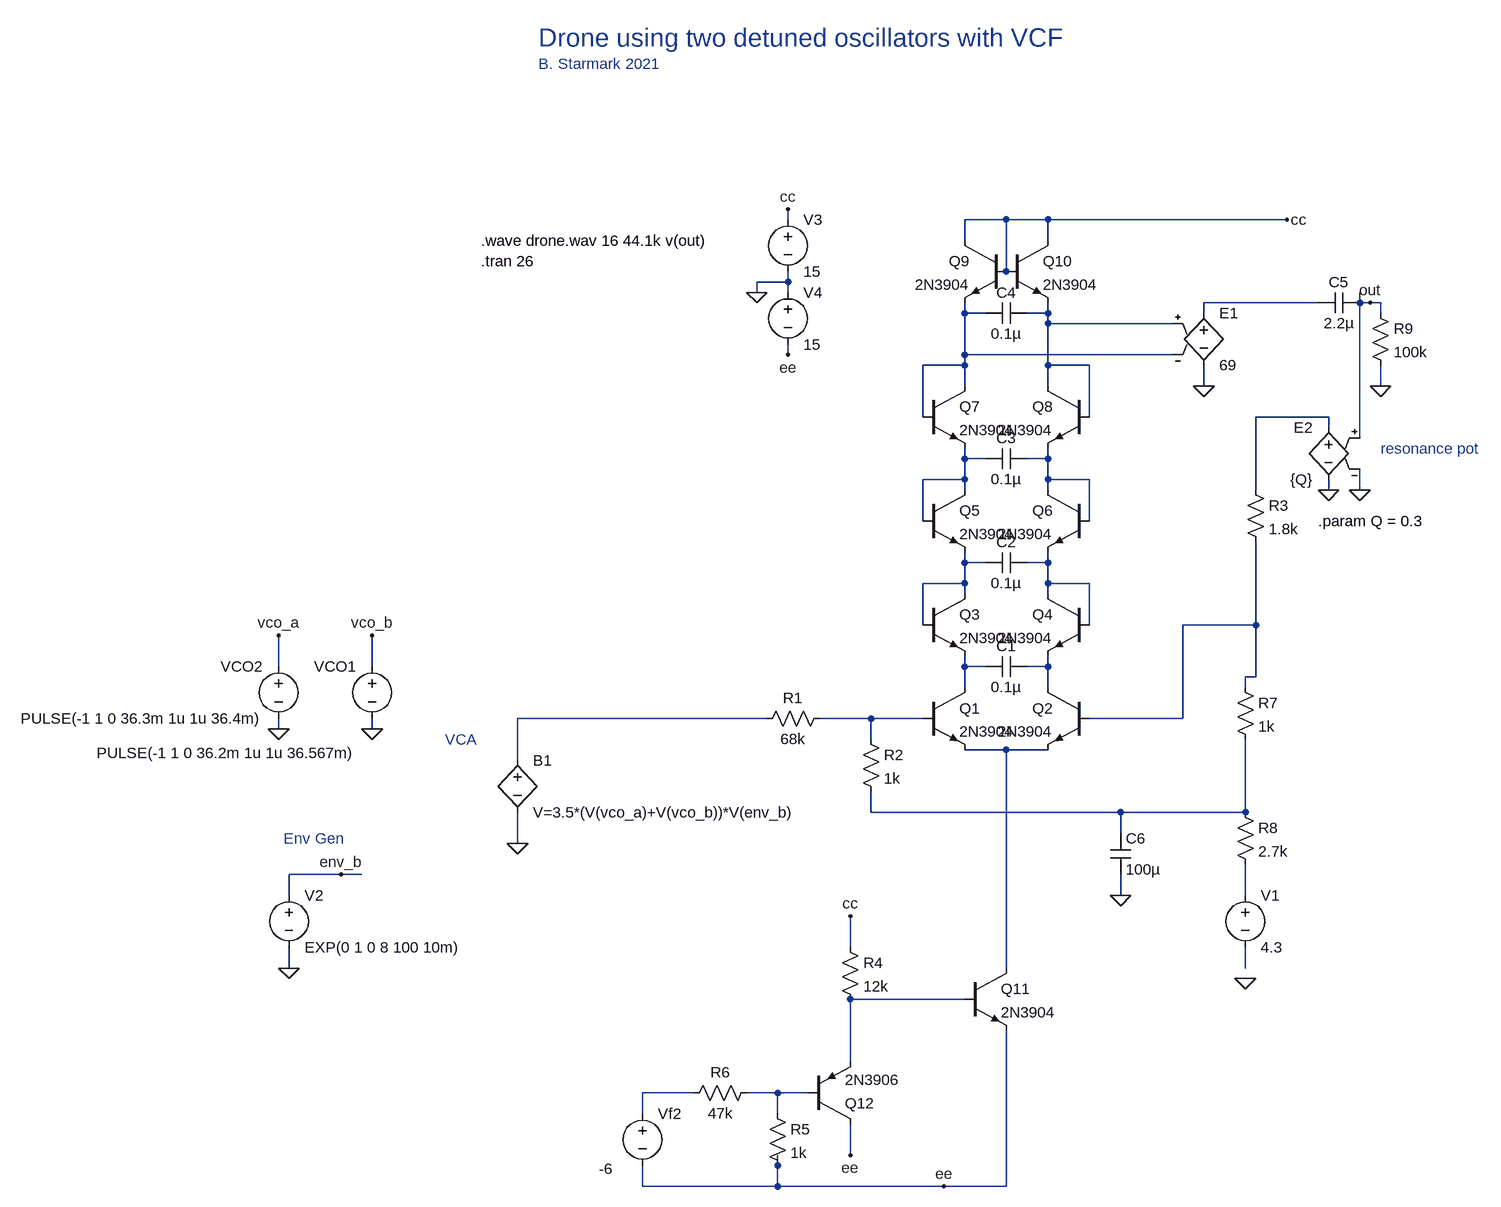
[diagram p0: schematic drone.asc]
drone.asc, the LTspice schematic file:
Version 4
SHEET 1 1536 820
WIRE -64 -752 -64 -768
WIRE 272 -752 208 -752
WIRE 336 -752 272 -752
WIRE 704 -752 336 -752
WIRE 208 -720 208 -752
WIRE 336 -720 336 -752
WIRE 272 -672 272 -752
WIRE -64 -656 -64 -672
WIRE -64 -656 -112 -656
WIRE -112 -640 -112 -656
WIRE -64 -640 -64 -656
WIRE 752 -624 576 -624
WIRE 816 -624 816 -640
WIRE 832 -624 816 -624
WIRE 848 -624 832 -624
WIRE 208 -608 208 -624
WIRE 240 -608 208 -608
WIRE 336 -608 336 -624
WIRE 336 -608 304 -608
WIRE 576 -608 576 -624
WIRE 848 -608 848 -624
WIRE 336 -592 336 -608
WIRE 528 -592 336 -592
WIRE -64 -544 -64 -560
WIRE 208 -544 208 -608
WIRE 528 -544 208 -544
WIRE 208 -528 208 -544
WIRE 208 -528 144 -528
WIRE 336 -528 336 -592
WIRE 400 -528 336 -528
WIRE 208 -496 208 -528
WIRE 336 -496 336 -528
WIRE 576 -496 576 -528
WIRE 848 -496 848 -528
WIRE 144 -448 144 -528
WIRE 400 -448 400 -528
WIRE 768 -448 656 -448
WIRE 768 -432 768 -448
WIRE 816 -416 816 -624
WIRE 208 -384 208 -400
WIRE 240 -384 208 -384
WIRE 336 -384 336 -400
WIRE 336 -384 304 -384
WIRE 208 -352 208 -384
WIRE 208 -352 144 -352
WIRE 336 -352 336 -384
WIRE 400 -352 336 -352
WIRE 208 -336 208 -352
WIRE 336 -336 336 -352
WIRE 656 -336 656 -448
WIRE 768 -336 768 -352
WIRE 816 -336 816 -368
WIRE 144 -288 144 -352
WIRE 400 -288 400 -352
WIRE 208 -224 208 -240
WIRE 240 -224 208 -224
WIRE 336 -224 336 -240
WIRE 336 -224 304 -224
WIRE 208 -192 208 -224
WIRE 208 -192 144 -192
WIRE 336 -192 336 -224
WIRE 400 -192 336 -192
WIRE 208 -176 208 -192
WIRE 336 -176 336 -192
WIRE 144 -128 144 -192
WIRE 400 -128 400 -192
WIRE 656 -128 656 -256
WIRE 656 -128 544 -128
WIRE -848 -64 -848 -112
WIRE -704 -64 -704 -112
WIRE 208 -64 208 -80
WIRE 240 -64 208 -64
WIRE 336 -64 336 -80
WIRE 336 -64 304 -64
WIRE 656 -48 656 -128
WIRE 656 -48 640 -48
WIRE 208 -32 208 -64
WIRE 336 -32 336 -64
WIRE 640 -32 640 -48
WIRE -96 16 -480 16
WIRE 64 16 -16 16
WIRE 144 16 64 16
WIRE 544 16 544 -128
WIRE 544 16 400 16
WIRE -848 32 -848 16
WIRE -704 32 -704 16
WIRE 64 48 64 16
WIRE 272 64 208 64
WIRE 336 64 272 64
WIRE -480 80 -480 16
WIRE 64 160 64 128
WIRE 448 160 64 160
WIRE 640 160 640 48
WIRE 640 160 448 160
WIRE 448 192 448 160
WIRE -480 208 -480 160
WIRE -752 256 -832 256
WIRE -720 256 -752 256
WIRE -832 288 -832 256
WIRE 448 288 448 256
WIRE 640 288 640 240
WIRE 32 368 32 320
WIRE -832 400 -832 368
WIRE 272 400 272 64
WIRE 640 400 640 368
WIRE 208 448 32 448
WIRE 32 544 32 448
WIRE -208 592 -288 592
WIRE -80 592 -128 592
WIRE -32 592 -80 592
WIRE -288 624 -288 592
WIRE -80 624 -80 592
WIRE 32 688 32 640
WIRE -80 704 -80 688
WIRE -288 736 -288 704
WIRE -80 736 -80 704
WIRE -80 736 -288 736
WIRE 176 736 -80 736
WIRE 272 736 272 496
WIRE 272 736 176 736
FLAG -112 -640 0
FLAG -64 -544 ee
FLAG -64 -768 cc
FLAG -480 208 0
FLAG 704 -752 cc
FLAG 848 -496 0
FLAG 576 -496 0
FLAG 32 320 cc
FLAG 32 688 ee
FLAG 176 736 ee
FLAG 816 -336 0
FLAG 768 -336 0
FLAG 640 416 0
FLAG 448 288 0
FLAG -848 -112 vco_a
FLAG -704 32 0
FLAG -704 -112 vco_b
FLAG -848 32 0
FLAG 832 -624 out
FLAG -832 400 0
FLAG -752 256 env_b
SYMBOL voltage -64 -768 R0
SYMATTR InstName V3
SYMATTR Value 15
SYMBOL voltage -64 -656 R0
SYMATTR InstName V4
SYMATTR Value 15
SYMBOL bv -480 64 R0
SYMATTR InstName B1
SYMATTR Value V=3.5*(V(vco_a)+V(vco_b))*V(env_b)
SYMBOL npn 144 -32 R0
SYMATTR InstName Q1
SYMATTR Value 2N3904
SYMBOL npn 400 -32 M0
SYMATTR InstName Q2
SYMATTR Value 2N3904
SYMBOL cap 304 -80 R90
WINDOW 0 0 32 VBottom 2
WINDOW 3 32 32 VTop 2
SYMATTR InstName C1
SYMATTR Value 0.1µ
SYMBOL npn 144 -176 R0
SYMATTR InstName Q3
SYMATTR Value 2N3904
SYMBOL npn 400 -176 M0
SYMATTR InstName Q4
SYMATTR Value 2N3904
SYMBOL cap 304 -240 R90
WINDOW 0 0 32 VBottom 2
WINDOW 3 32 32 VTop 2
SYMATTR InstName C2
SYMATTR Value 0.1µ
SYMBOL npn 144 -336 R0
SYMATTR InstName Q5
SYMATTR Value 2N3904
SYMBOL npn 400 -336 M0
SYMATTR InstName Q6
SYMATTR Value 2N3904
SYMBOL cap 304 -400 R90
WINDOW 0 0 32 VBottom 2
WINDOW 3 32 32 VTop 2
SYMATTR InstName C3
SYMATTR Value 0.1µ
SYMBOL npn 144 -496 R0
SYMATTR InstName Q7
SYMATTR Value 2N3904
SYMBOL npn 400 -496 M0
SYMATTR InstName Q8
SYMATTR Value 2N3904
SYMBOL cap 304 -624 R90
WINDOW 0 0 32 VBottom 2
WINDOW 3 32 32 VTop 2
SYMATTR InstName C4
SYMATTR Value 0.1µ
SYMBOL npn 272 -720 M0
SYMATTR InstName Q9
SYMATTR Value 2N3904
SYMBOL npn 272 -720 R0
SYMATTR InstName Q10
SYMATTR Value 2N3904
SYMBOL cap 752 -608 R270
WINDOW 0 32 32 VTop 2
WINDOW 3 0 32 VBottom 2
SYMATTR InstName C5
SYMATTR Value 2.2µ
SYMBOL res 832 -624 R0
SYMATTR InstName R9
SYMATTR Value 100k
SYMBOL e 576 -624 R0
SYMATTR InstName E1
SYMATTR Value 69
SYMBOL res 0 0 R90
WINDOW 0 0 56 VBottom 2
WINDOW 3 32 56 VTop 2
SYMATTR InstName R1
SYMATTR Value 68k
SYMBOL res 48 32 R0
SYMATTR InstName R2
SYMATTR Value 1k
SYMBOL npn 208 400 R0
SYMATTR InstName Q11
SYMATTR Value 2N3904
SYMBOL pnp -32 640 M180
SYMATTR InstName Q12
SYMATTR Value 2N3906
SYMBOL res 16 352 R0
SYMATTR InstName R4
SYMATTR Value 12k
SYMBOL res -96 608 R0
SYMATTR InstName R5
SYMATTR Value 1k
SYMBOL res -112 576 R90
WINDOW 0 0 56 VBottom 2
WINDOW 3 32 56 VTop 2
SYMATTR InstName R6
SYMATTR Value 47k
SYMBOL e 768 -448 M0
SYMATTR InstName E2
SYMATTR Value {Q}
SYMBOL res 640 -352 R0
SYMATTR InstName R3
SYMATTR Value 1.8k
SYMBOL res 624 -48 R0
SYMATTR InstName R7
SYMATTR Value 1k
SYMBOL res 624 144 R0
SYMATTR InstName R8
SYMATTR Value 2.7k
SYMBOL voltage 640 272 R0
SYMATTR InstName V1
SYMATTR Value 4.3
SYMBOL cap 432 192 R0
SYMATTR InstName C6
SYMATTR Value 100µ
SYMBOL voltage -704 -80 M0
WINDOW 123 24 124 Left 2
WINDOW 39 0 0 Left 2
WINDOW 3 24 149 Left 2
SYMATTR InstName VCO1
SYMATTR Value PULSE(-1 1 0 36.2m 1u 1u 36.567m)
SYMBOL voltage -848 -80 M0
WINDOW 123 24 124 Left 2
WINDOW 39 0 0 Left 2
SYMATTR InstName VCO2
SYMATTR Value PULSE(-1 1 0 36.3m 1u 1u 36.4m)
SYMBOL voltage -288 608 R0
WINDOW 123 0 0 Left 0
WINDOW 39 0 0 Left 0
WINDOW 3 -67 101 Left 2
SYMATTR Value -6
SYMATTR InstName Vf2
SYMBOL voltage -832 272 R0
WINDOW 123 0 0 Left 0
WINDOW 39 0 0 Left 0
SYMATTR InstName V2
SYMATTR Value EXP(0 1 0 8 100 10m)
TEXT -536 -688 Left 2 !.tran 26
TEXT -448 -1032 Left 4 ;Drone using two detuned oscillators with VCF
TEXT -536 -720 Left 2 !.wave drone.wav 16 44.1k v(out)
TEXT 848 -400 Left 2 ;resonance pot
TEXT 752 -288 Left 2 !.param Q = 0.3
TEXT -592 48 Left 2 ;VCA
TEXT -840 200 Left 2 ;Env Gen
TEXT -448 -992 Left 2 ;B. Starmark 2021

The netlist it stands for:
* drone.asc
V3 cc 0 15
V4 0 ee 15
B1 N012 0 V=3.5*(V(vco_a)+V(vco_b))*V(env_b)
Q1 N010 N013 N014 0 2N3904
Q2 N011 N009 N014 0 2N3904
C1 N011 N010 0.1µ
Q3 N007 N007 N010 0 2N3904
Q4 N008 N008 N011 0 2N3904
C2 N008 N007 0.1µ
Q5 N005 N005 N007 0 2N3904
Q6 N006 N006 N008 0 2N3904
C3 N006 N005 0.1µ
Q7 N002 N002 N005 0 2N3904
Q8 N003 N003 N006 0 2N3904
C4 N003 N002 0.1µ
Q9 cc cc N002 0 2N3904
Q10 cc cc N003 0 2N3904
C5 N001 out 2.2µ
R9 out 0 100k
E1 N001 0 N003 N002 69
R1 N013 N012 68k
R2 N013 N015 1k
Q11 N014 N018 ee 0 2N3904
Q12 ee N020 N018 0 2N3906
R4 cc N018 12k
R5 N020 ee 1k
R6 N020 N019 47k
E2 N004 0 out 0 {Q}
R3 N004 N009 1.8k
R7 N009 N015 1k
R8 N015 N016 2.7k
V1 N016 N017 4.3
C6 N015 0 100µ
VCO1 vco_b 0 PULSE(-1 1 0 36.2m 1u 1u 36.567m)
VCO2 vco_a 0 PULSE(-1 1 0 36.3m 1u 1u 36.4m)
Vf2 N019 ee -6
V2 env_b 0 EXP(0 1 0 8 100 10m)
.model NPN NPN
.model PNP PNP
.lib standard.bjt
.tran 26
* Drone using two detuned oscillators with VCF
.wave drone.wav 16 44.1k v(out)
* resonance pot
.param Q = 0.3
* VCA
* Env Gen
* B. Starmark 2021
.backanno
.end